# EAGLE schematic MBO (EAGLE 7.4.0)
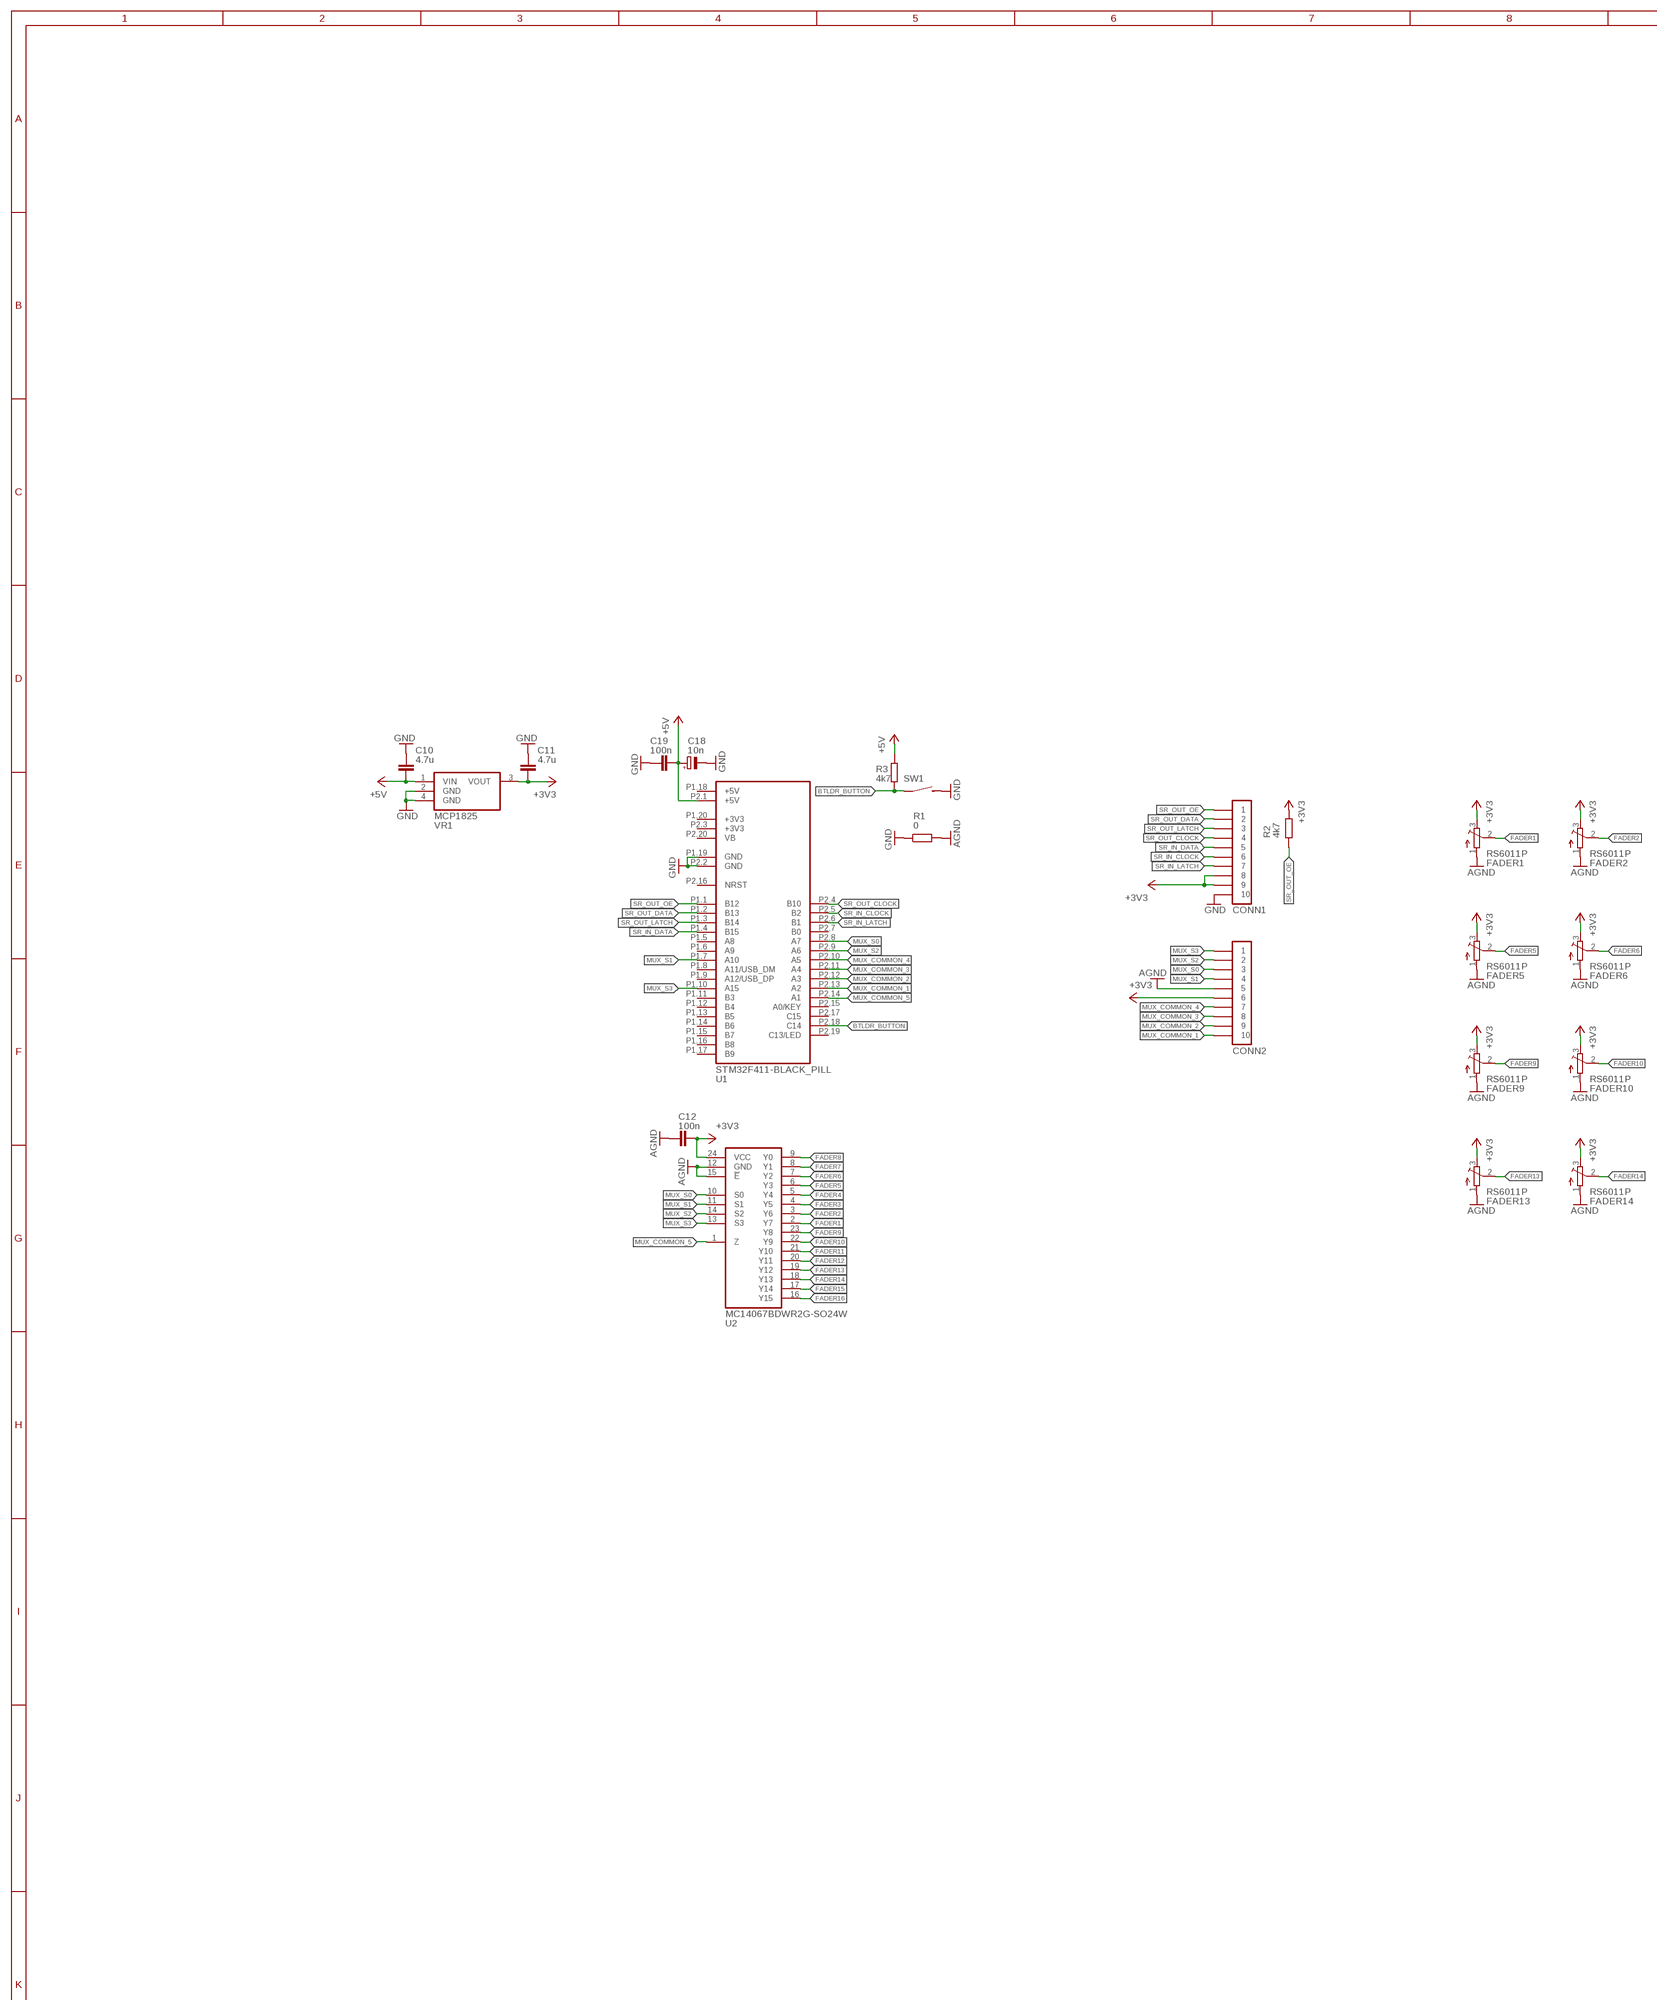
[diagram p0: schematic, sheet 1, part 1 of 3]
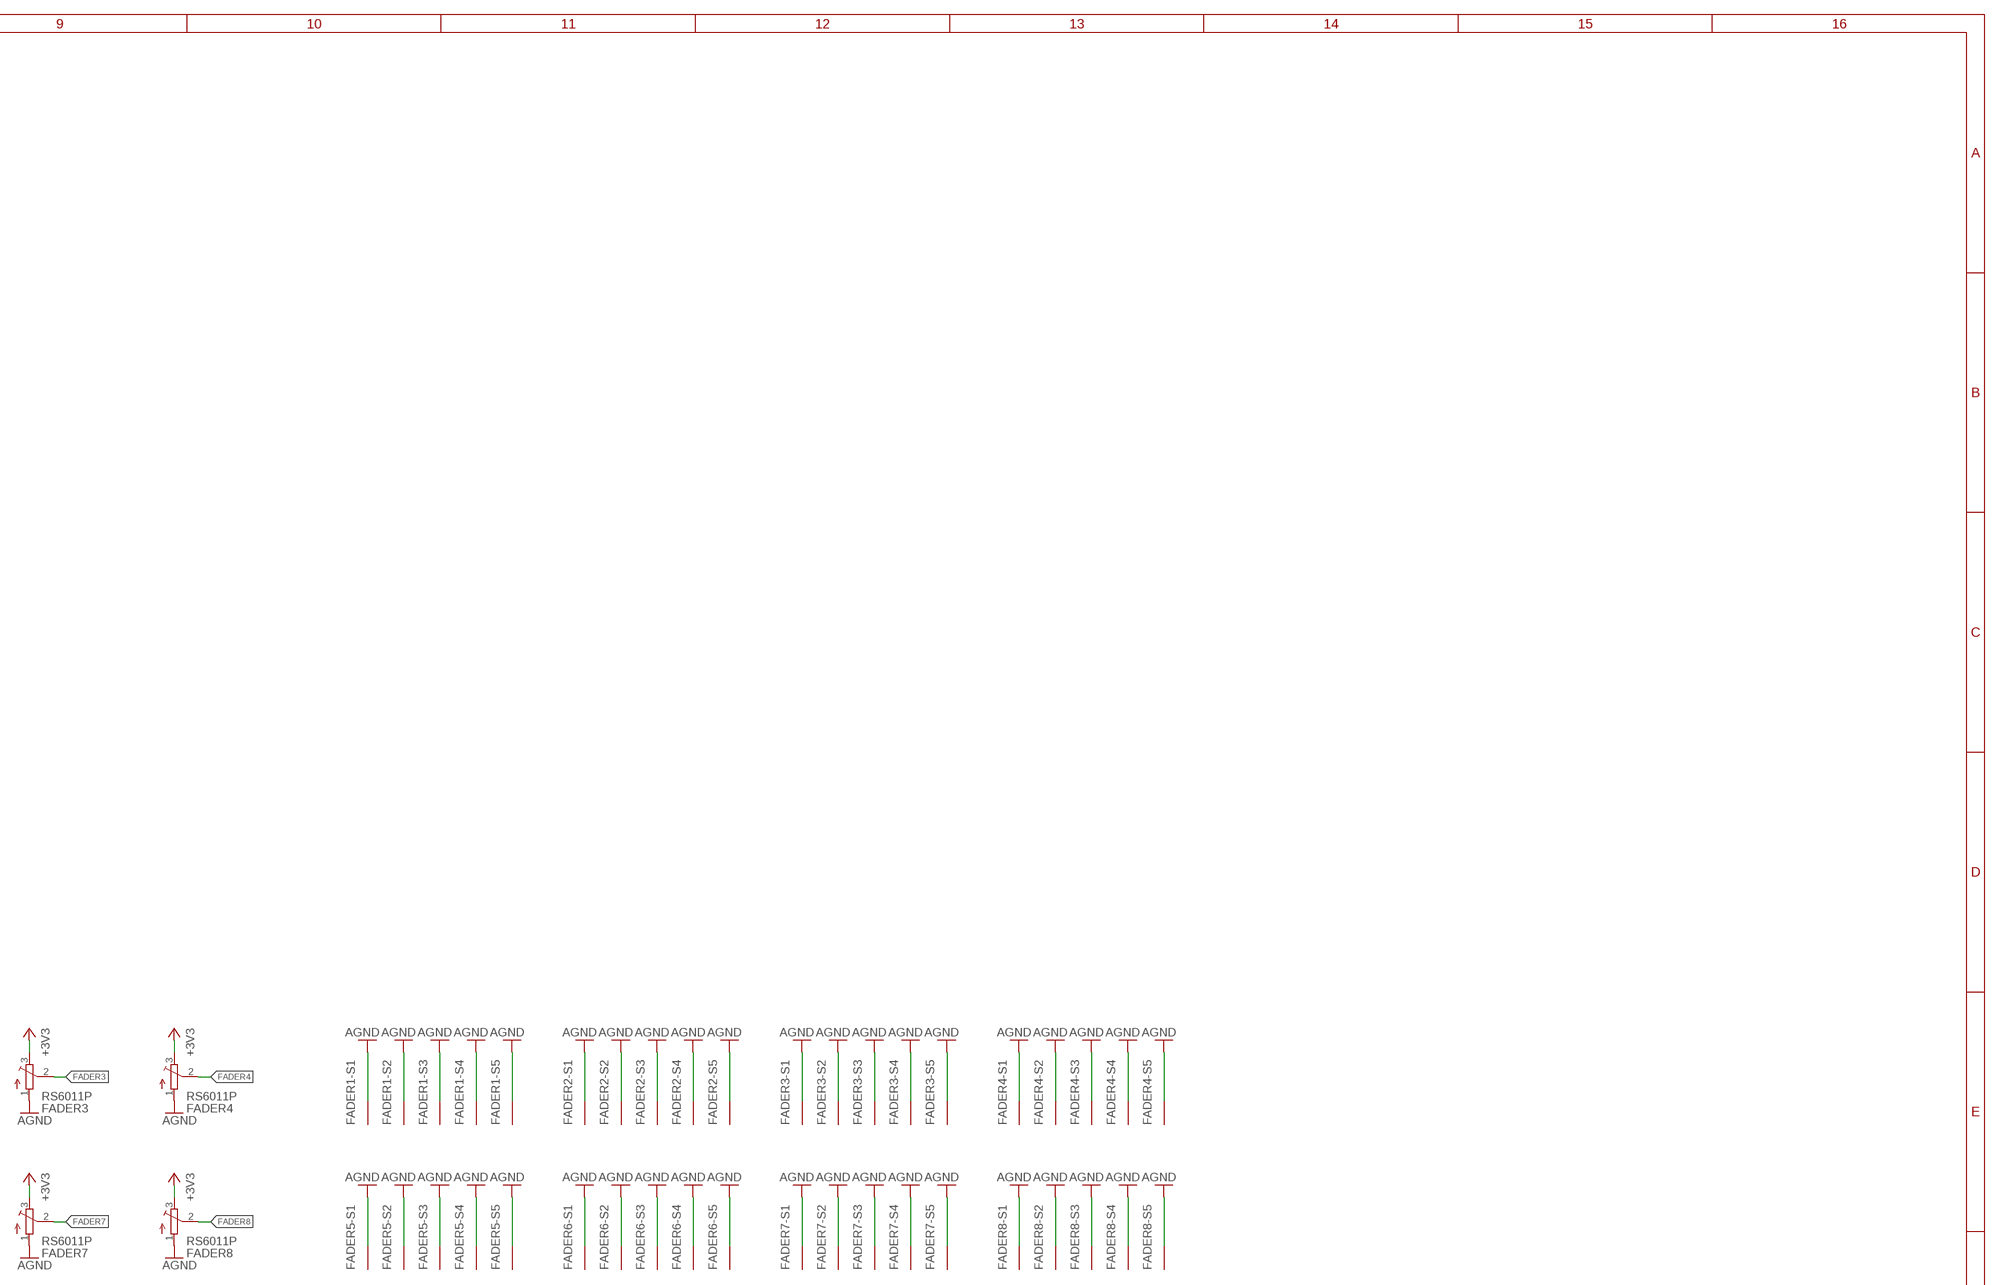
[diagram p1: schematic, sheet 1, part 2 of 3]
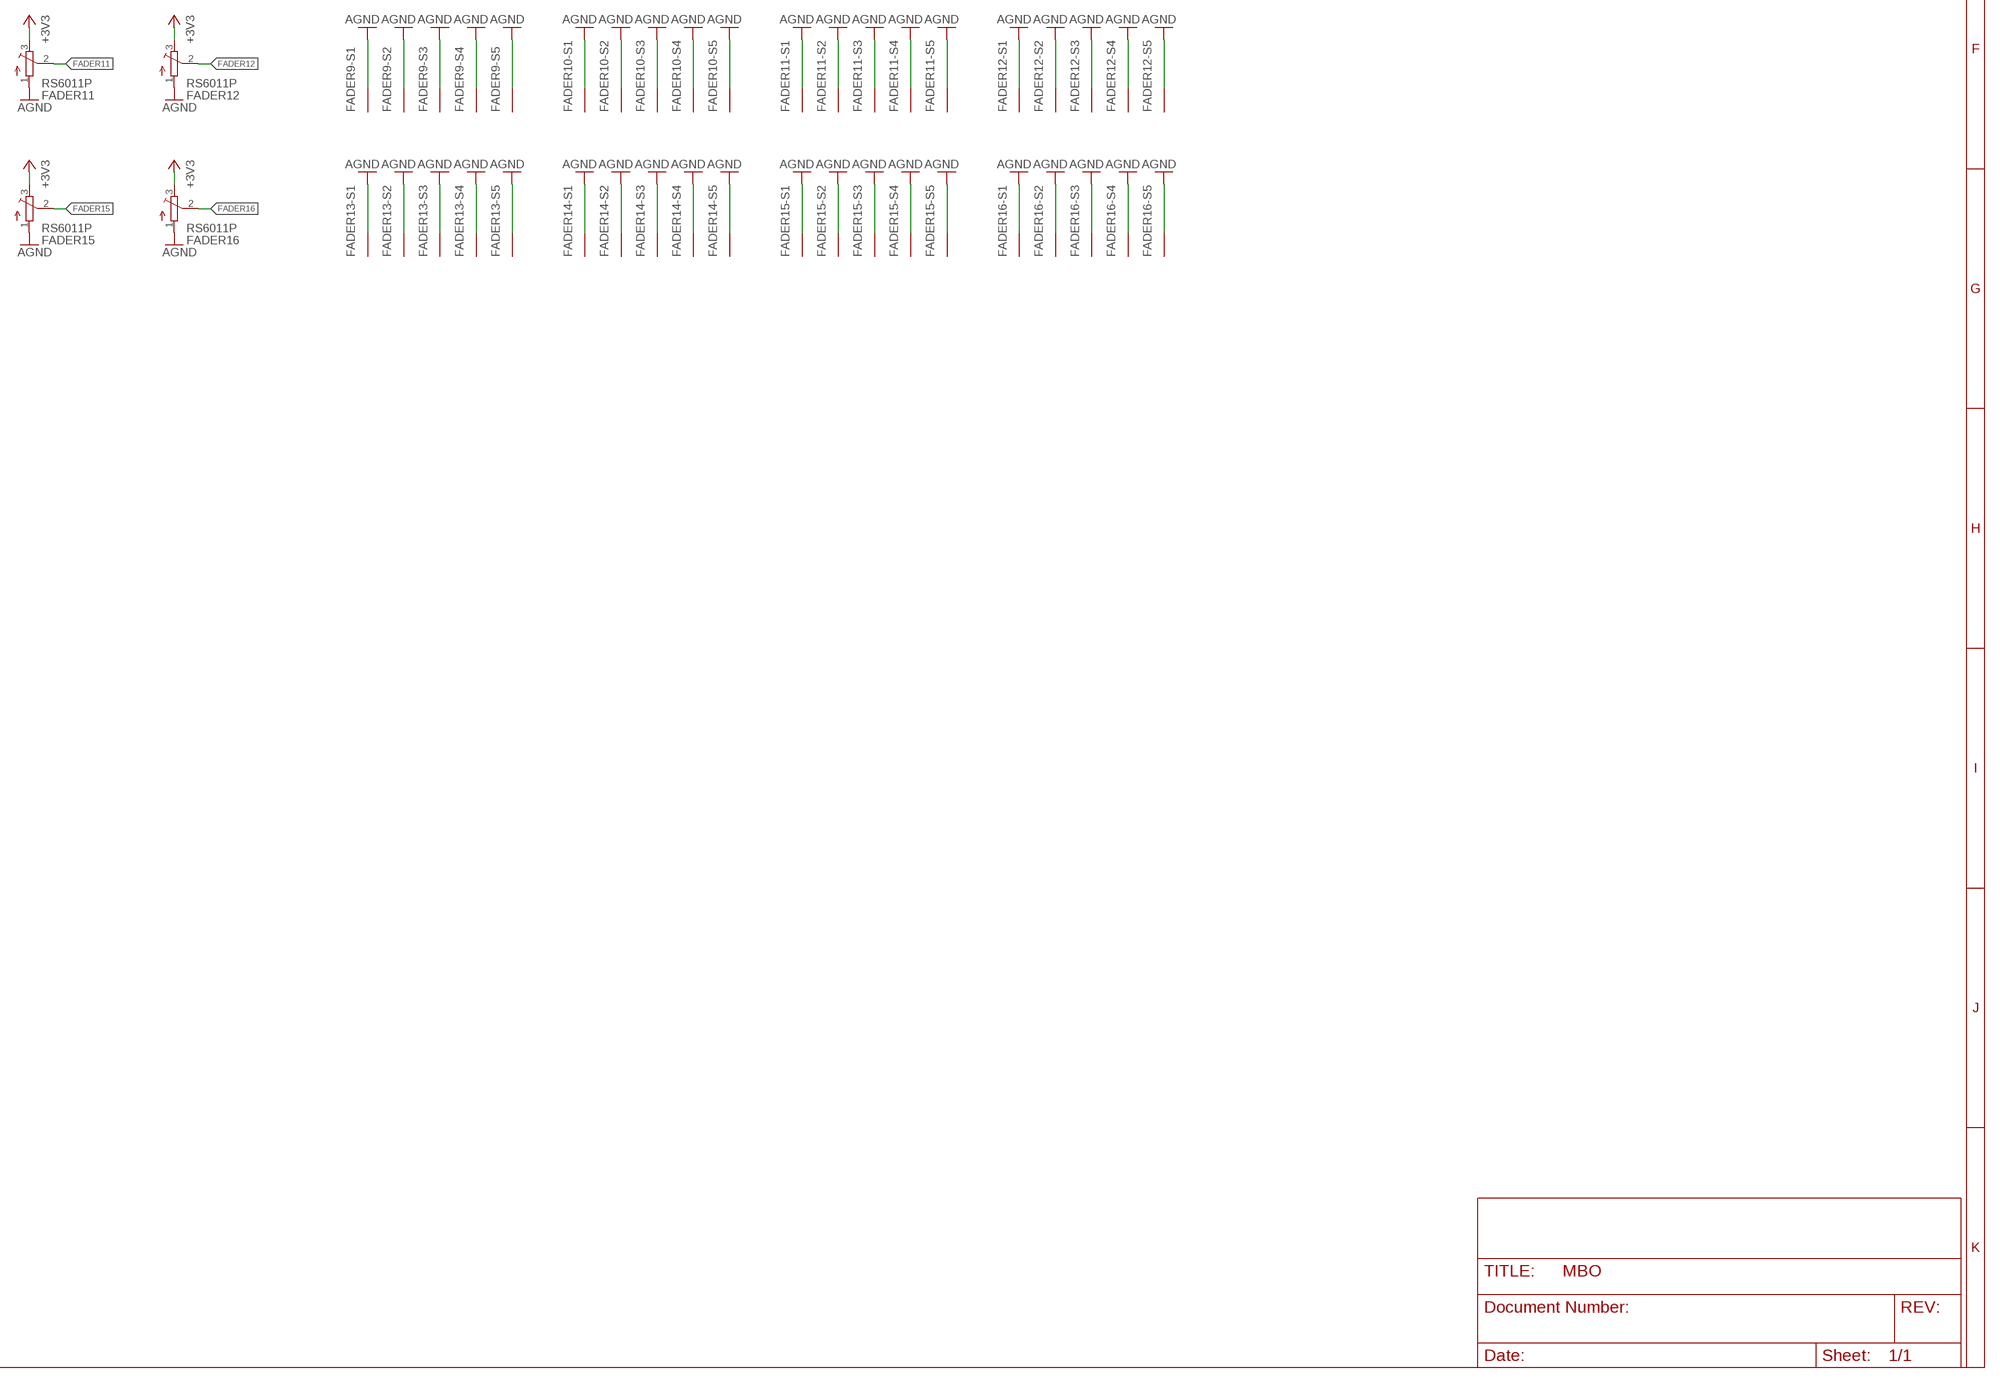
[diagram p2: schematic, sheet 1, part 3 of 3]

## Parts
C10  4.7u  CAPACITOR-0805  [C0805]
C11  4.7u  CAPACITOR-0805  [C0805]
C12  100n  CAPACITOR-0805  [C0805]
C18  10n  ELECTROLYTIC_CAPACITOR-C-TH-E-0401  [C-TH-E-0401]
C19  100n  CAPACITOR-0805  [C0805]
CONN1  PINHD-1X10-FFC-1MM-Z  [MOLEX-52271-1079]
CONN2  PINHD-1X10-FFC-1MM-Z  [MOLEX-52271-1079]
FADER1  RS6011P  [RS6011*P]
FADER2  RS6011P  [RS6011*P]
FADER3  RS6011P  [RS6011*P]
FADER4  RS6011P  [RS6011*P]
FADER5  RS6011P  [RS6011*P]
FADER6  RS6011P  [RS6011*P]
FADER7  RS6011P  [RS6011*P]
FADER8  RS6011P  [RS6011*P]
FADER9  RS6011P  [RS6011*P]
FADER10  RS6011P  [RS6011*P]
FADER11  RS6011P  [RS6011*P]
FADER12  RS6011P  [RS6011*P]
FADER13  RS6011P  [RS6011*P]
FADER14  RS6011P  [RS6011*P]
FADER15  RS6011P  [RS6011*P]
FADER16  RS6011P  [RS6011*P]
R1  0  RESISTOR-0805  [R0805]
R2  4k7  RESISTOR-0805  [R0805]
R3  4k7  RESISTOR-0805  [R0805]
SW1  SWITCH-TACT-TH-6X6MM  [TACT_SW_6X6MM]
U1  STM32F411-BLACK_PILL  [STM32F411-BLACK_PILL]
U2  MC14067BDWR2G-SO24W  [SO24-W]
VR1  MCP1825  [SOT223]

## Nets
+3V3: C11.1 C12.1 CONN1.8 CONN1.9 CONN2.6 FADER1.3 FADER2.3 FADER3.3 FADER4.3 FADER5.3 FADER6.3 FADER7.3 FADER8.3 FADER9.3 FADER10.3 FADER11.3 FADER12.3 FADER13.3 FADER14.3 FADER15.3 FADER16.3 R2.2 U2.24(VCC) VR1.3(VOUT)
+5V: C10.1 C18.+ C19.1 R3.1 U1.P2.1(+5V) VR1.1(VIN)
AGND: C12.2 CONN2.5 FADER1.1 FADER1.S1(S) FADER1.S2(S) FADER1.S3(S) FADER1.S4(S) FADER1.S5(S) FADER2.1 FADER2.S1(S) FADER2.S2(S) FADER2.S3(S) FADER2.S4(S) FADER2.S5(S) FADER3.1 FADER3.S1(S) FADER3.S2(S) FADER3.S3(S) FADER3.S4(S) FADER3.S5(S) FADER4.1 FADER4.S1(S) FADER4.S2(S) FADER4.S3(S) FADER4.S4(S) FADER4.S5(S) FADER5.1 FADER5.S1(S) FADER5.S2(S) FADER5.S3(S) FADER5.S4(S) FADER5.S5(S) FADER6.1 FADER6.S1(S) FADER6.S2(S) FADER6.S3(S) FADER6.S4(S) FADER6.S5(S) FADER7.1 FADER7.S1(S) FADER7.S2(S) FADER7.S3(S) FADER7.S4(S) FADER7.S5(S) FADER8.1 FADER8.S1(S) FADER8.S2(S) FADER8.S3(S) FADER8.S4(S) FADER8.S5(S) FADER9.1 FADER9.S1(S) FADER9.S2(S) FADER9.S3(S) FADER9.S4(S) FADER9.S5(S) FADER10.1 FADER10.S1(S) FADER10.S2(S) FADER10.S3(S) FADER10.S4(S) FADER10.S5(S) FADER11.1 FADER11.S1(S) FADER11.S2(S) FADER11.S3(S) FADER11.S4(S) FADER11.S5(S) FADER12.1 FADER12.S1(S) FADER12.S2(S) FADER12.S3(S) FADER12.S4(S) FADER12.S5(S) FADER13.1 FADER13.S1(S) FADER13.S2(S) FADER13.S3(S) FADER13.S4(S) FADER13.S5(S) FADER14.1 FADER14.S1(S) FADER14.S2(S) FADER14.S3(S) FADER14.S4(S) FADER14.S5(S) FADER15.1 FADER15.S1(S) FADER15.S2(S) FADER15.S3(S) FADER15.S4(S) FADER15.S5(S) FADER16.1 FADER16.S1(S) FADER16.S2(S) FADER16.S3(S) FADER16.S4(S) FADER16.S5(S) R1.2 U2.12(GND) U2.15(!E)
BTLDR_BUTTON: R3.2 SW1.A1 U1.P2.18(C14)
FADER1: FADER1.2 U2.2(Y7)
FADER2: FADER2.2 U2.3(Y6)
FADER3: FADER3.2 U2.4(Y5)
FADER4: FADER4.2 U2.5(Y4)
FADER5: FADER5.2 U2.6(Y3)
FADER6: FADER6.2 U2.7(Y2)
FADER7: FADER7.2 U2.8(Y1)
FADER8: FADER8.2 U2.9(Y0)
FADER9: FADER9.2 U2.23(Y8)
FADER10: FADER10.2 U2.22(Y9)
FADER11: FADER11.2 U2.21(Y10)
FADER12: FADER12.2 U2.20(Y11)
FADER13: FADER13.2 U2.19(Y12)
FADER14: FADER14.2 U2.18(Y13)
FADER15: FADER15.2 U2.17(Y14)
FADER16: FADER16.2 U2.16(Y15)
GND: C10.2 C11.2 C18.- C19.2 CONN1.10 R1.1 SW1.B1 U1.P1.19(GND) U1.P2.2(GND) VR1.2(GND) VR1.4(GND)
MUX_COMMON_1: CONN2.10 U1.P2.13(A2)
MUX_COMMON_2: CONN2.9 U1.P2.12(A3)
MUX_COMMON_3: CONN2.8 U1.P2.11(A4)
MUX_COMMON_4: CONN2.7 U1.P2.10(A5)
MUX_COMMON_5: U1.P2.14(A1) U2.1(Z)
MUX_S0: CONN2.3 U1.P2.8(A7) U2.10(S0)
MUX_S1: CONN2.4 U1.P1.7(A10) U2.11(S1)
MUX_S2: CONN2.2 U1.P2.9(A6) U2.14(S2)
MUX_S3: CONN2.1 U1.P1.10(A15) U2.13(S3)
SR_IN_CLOCK: CONN1.6 U1.P2.5(B2)
SR_IN_DATA: CONN1.5 U1.P1.4(B15)
SR_IN_LATCH: CONN1.7 U1.P2.6(B1)
SR_OUT_CLOCK: CONN1.4 U1.P2.4(B10)
SR_OUT_DATA: CONN1.2 U1.P1.2(B13)
SR_OUT_LATCH: CONN1.3 U1.P1.3(B14)
SR_OUT_OE: CONN1.1 R2.1 U1.P1.1(B12)
Unconnected: U1.P1.5(A8) U1.P1.6(A9) U1.P1.8(A11/USB_DM) U1.P1.9(A12/USB_DP) U1.P1.11(B3) U1.P1.12(B4) U1.P1.13(B5) U1.P1.14(B6) U1.P1.15(B7) U1.P1.16(B8) U1.P1.17(B9) U1.P1.18(+5V) U1.P1.20(+3V3) U1.P2.3(+3V3) U1.P2.7(B0) U1.P2.15(A0/KEY) U1.P2.16(NRST) U1.P2.17(C15) U1.P2.19(C13/LED) U1.P2.20(VB)

## Library data of the parts
C10-C12 C19 = igor_lbr:CAPACITOR: Capacitor
C18 = igor_lbr:ELECTROLYTIC_CAPACITOR: Electrolytic capacitor
CONN1 CONN2 = igor_lbr:PINHD-1X10: Pin header; MANUFACTURER: Molex; MPN: 52271-1079
FADER1-FADER16 = igor_lbr:RS6011*P: Potentiometer
R1-R3 = igor_lbr:RESISTOR: Resistor
SW1 = igor_lbr:SWITCH: Switch
U1 = igor_lbr:STM32F411-BLACK_PILL: STM32F411 Black Pill development board
U2 = igor_lbr:MC14067BDWR2G: 16-Channel Analog Multiplexer/Demultiplexer; MANUFACTURER: ON Semiconductor; MPN: MC14067BDWR2G
VR1 = igor_lbr:MCP1825: 500 mA, Low Voltage, Low Quiescent Current LDO Regulator; MANUFACTURER: Microchip; MPN: MCP1825S-3302E/DB